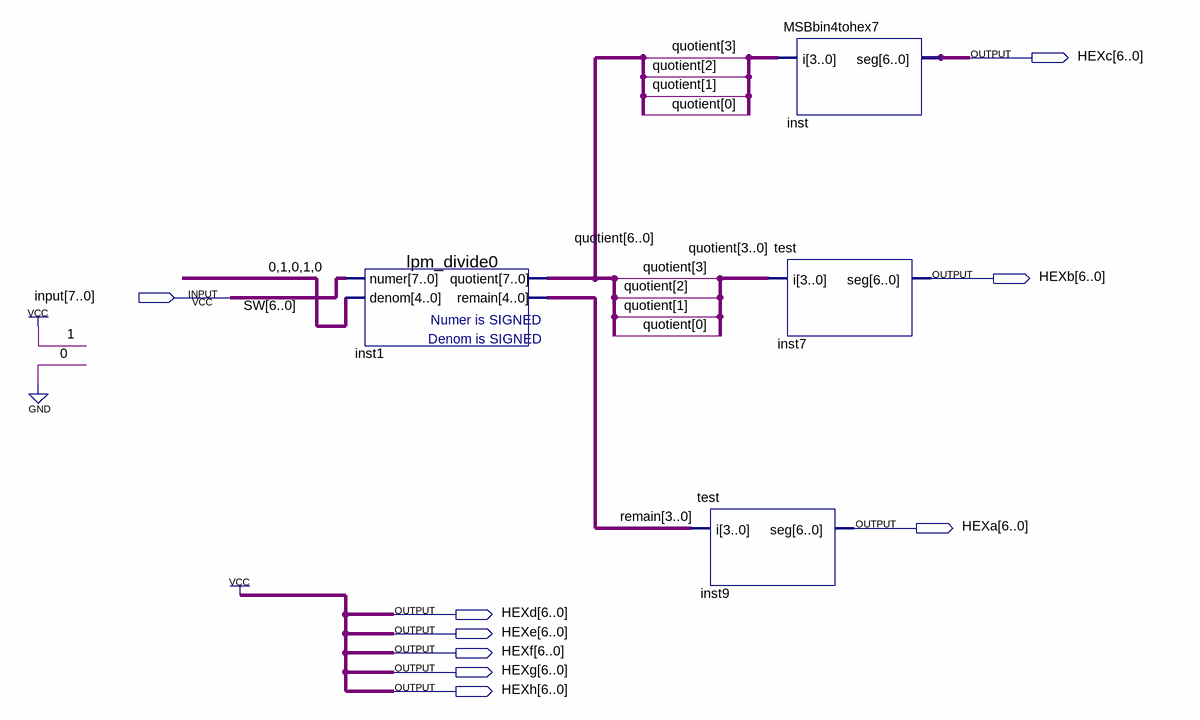
[diagram p0: schematic sheet]
// Quartus schematic +veaddresult.bdf as structural Verilog: 4 symbols, 9 pins
module \+veaddresult  (
  input  [7:0] \input ,
  output [6:0] HEXc,
  output [6:0] HEXb,
  output [6:0] HEXa,
  output [6:0] HEXd,
  output [6:0] HEXe,
  output [6:0] HEXf,
  output [6:0] HEXg,
  output [6:0] HEXh
);

  wire [3:0] remain, undriven;
  wire [6:0] quotient, SW;

  lpm_divide0 inst1 (.numer(SW), .denom(5'b01010), .quotient(quotient), .remain(remain));
  test inst9 (.i(remain), .seg(HEXa));
  MSBbin4tohex7 inst (.i(undriven), .seg(HEXc));
  test inst7 (.i(quotient[3:0]), .seg(HEXb));

  assign HEXd = {7{1'b1}};
  assign HEXe = {7{1'b1}};
  assign HEXf = {7{1'b1}};
  assign HEXg = {7{1'b1}};
  assign HEXh = {7{1'b1}};
endmodule
